# Altium schematic sheet PCB四轴接口.SchDoc: Template
size A4; CompanyName: BUPT; DrawnBy: BUPT_HCM; Organization: BUPT_Robot; Revision: A; SheetNumber: 1; SheetTotal: 1; Version: 0.0; LibVersion: 0.0
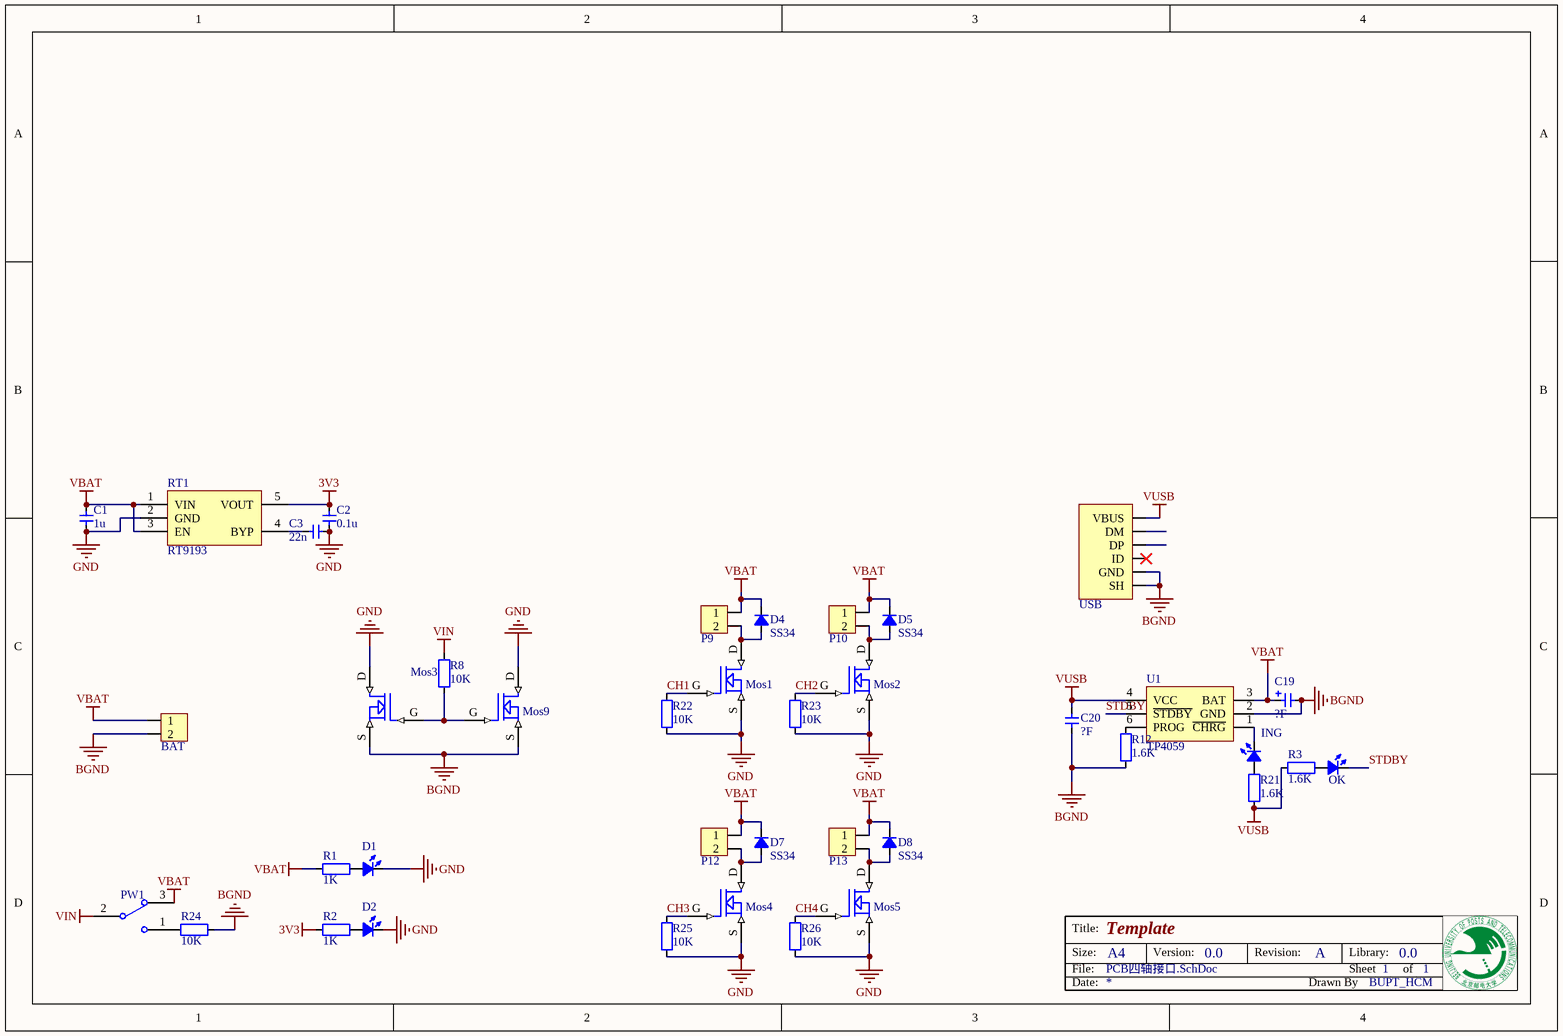
[diagram p0: PCB四轴接口.SchDoc]

## Parts
BAT  HDR1x2_2.54  [HDR1X2_2.54_90]  (value not drawn)
C1  value 1u  [CAP_0603]  (hidden comment: Cap_0603)
C2  value 0.1u  [CAP_0603]  (hidden comment: Cap_0603)
C3  value 22n  [CAP_0603]  (hidden comment: Cap_0603)
C19  value ?F  [CAP_TAN_D2917]  (hidden comment: Cap_Tan_2917)
C20  value ?F  [CAP_0805]  (hidden comment: Cap_0805)
D1  LED_0805  [LED_0805_YELLOW]  (value not drawn)
D2  LED_0805  [LED_0805_YELLOW]  (value not drawn)
D4  value SS34  [DO-214AC]  (hidden comment: Diode_SMA)
D5  value SS34  [DO-214AC]  (hidden comment: Diode_SMA)
D7  value SS34  [DO-214AC]  (hidden comment: Diode_SMA)
D8  value SS34  [DO-214AC]  (hidden comment: Diode_SMA)
ING  LED_0805  [LED_0805_RED]  (value not drawn)
Mos1  MOSFET N  [Nmos_SOT23]  (value not drawn)
Mos2  MOSFET N  [Nmos_SOT23]  (value not drawn)
Mos3  MOSFET N  [Nmos_SOT23]  (value not drawn)
Mos4  MOSFET N  [Nmos_SOT23]  (value not drawn)
Mos5  MOSFET N  [Nmos_SOT23]  (value not drawn)
Mos9  MOSFET N  [Nmos_SOT23]  (value not drawn)
OK  LED_0805  [LED_0805_GREEN]  (value not drawn)
P9  HDR1x2_2.54  [HDR1X2_2.54_180]  (value not drawn)
P10  HDR1x2_2.54  [HDR1X2_2.54_180]  (value not drawn)
P12  HDR1x2_2.54  [HDR1X2_2.54_180]  (value not drawn)
P13  HDR1x2_2.54  [HDR1X2_2.54_180]  (value not drawn)
PW1  SwitchSPDT_2.8x6.6_90  [SwitchSPDT_2.8X6.6_90]  (value not drawn)
R1  value 1K  [RES_0603]  (hidden comment: Res_0603)
R2  value 1K  [RES_0603]  (hidden comment: Res_0603)
R3  value 1.6K  [RES_0603]  (hidden comment: Res_0603)
R8  value 10K  [RES_0603]  (hidden comment: Res_0603)
R12  value 1.6K  [RES_0603]  (hidden comment: Res_0603)
R21  value 1.6K  [RES_0603]  (hidden comment: Res_0603)
R22  value 10K  [RES_0603]  (hidden comment: Res_0603)
R23  value 10K  [RES_0603]  (hidden comment: Res_0603)
R24  value 10K  [RES_0603]  (hidden comment: Res_0603)
R25  value 10K  [RES_0603]  (hidden comment: Res_0603)
R26  value 10K  [RES_0603]  (hidden comment: Res_0603)
RT1  RT9193  [SOT23-5]
U1  TP4059  [SOT23-6]
USB  USB_Micro  [USB_Micro-AB]  (value not drawn)

## Nets
3V3: C2.2 R2.1 RT1.5(VOUT)
BGND: BAT.2 C19.2 C20.1 Mos3.S Mos9.S R12.2 R24.2 U1.2(GND) USB.0(SH) USB.5(GND)
GND: C1.1 C2.1 C3.1 D1.2(K) D2.2(K) Mos1.S Mos2.S Mos3.D Mos4.S Mos5.S Mos9.D R22.1 R23.1 R25.1 R26.1 RT1.2(GND)
VBAT: BAT.1 C1.2 C19.1 D4.2(K) D5.2(K) D7.2(K) D8.2(K) P9.1 P10.1 P12.1 P13.1 PW1.3 R1.1 RT1.1(VIN) RT1.3(EN) U1.3(BAT)
VIN: PW1.2 R8.2
VUSB: C20.2 R3.1 R21.2 U1.4(VCC) USB.1(VBUS)
CH1: Mos1.G R22.2
CH2: Mos2.G R23.2
CH3: Mos4.G R25.2
CH4: Mos5.G R26.2
STDBY: OK.2(K) U1.5(~{STDBY})
NetC3_2: C3.2 RT1.4(BYP)
NetD1_1: D1.1(A) R1.2
NetD2_1: D2.1(A) R2.2
NetD4_1: D4.1(A) Mos1.D P9.2
NetD5_1: D5.1(A) Mos2.D P10.2
NetD7_1: D7.1(A) Mos4.D P12.2
NetD8_1: D8.1(A) Mos5.D P13.2
NetING_1: ING.1(A) R21.1
NetING_2: ING.2(K) U1.1(~{CHRG})
NetMos3_G: Mos3.G Mos9.G R8.1
NetOK_1: OK.1(A) R3.2
NetPW1_1: PW1.1 R24.1
NetR12_1: R12.1 U1.6(PROG)

Not connected (* = marked no-connect by the designer): USB 2(DM) 3(DP) 4(ID)*

## Notes on the sheet
- Title:
- Size:
- Date:
- File:
- A4
- Version:
- Revision:
- Drawn By
- Sheet
- Library:
- of

## Library data of the parts
BAT = HDR1x2_2.54: Header
C1-C3 = Cap_0603: Capacitor
C19 = Cap_Tan_2917: Capacitor
C20 = Cap_0805: Capacitor
D1 D2 ING OK = LED_0805: LED
D4 D5 D7 D8 = Diode_SMA: Diode
Mos1-Mos5 Mos9 = MOSFET N: MOS SOT23
P9 P10 P12 P13 = HDR1x2_2.54T: Header
PW1 = SwitchSPDT_2.8x6.6_90: Switch
R1-R3 R8 R12 R21-R26 = Res_0603: Resistor
RT1 = RT9193: Power
USB = USB_Micro: USB